# EAGLE design tvbnull-10mm (EAGLE 5.10)
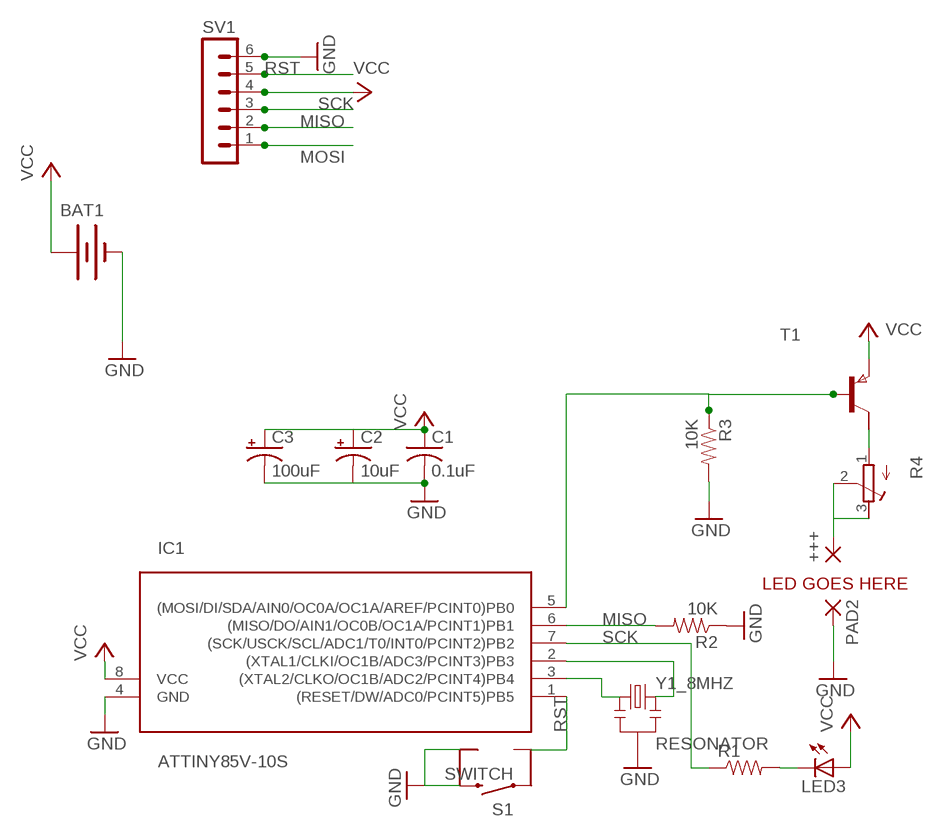
[diagram p0: schematic, sheet 1]

## Parts
+++  SMD5  [SMD2,54-5,08]
BAT1  BATTERYCR123A  [BATTERY_CR123A]
C1  0.1uF  C-USC0603K  [C0603K]
C2  10uF  CAP_POL1206  [EIA3216]
C3  100uF  CAP_POL7343  [EIA7343]
IC1  ATTINY85V-10S  [SOIC8]
LED3  LEDCHIPLED_1206  [CHIPLED_1206]
PAD2  SMD5  [SMD2,54-5,08]
R1  1.5K  RESISTOR1206  [1206]
R2  10K  RESISTOR  [0805]
R3  10K  RESISTOR  [0805]
R4  R-TRIMM3103  [RTRIM3103]
S1  SWITCH  SWITCH-MOMENTARY-2SMD  [TACTILE_SWITCH_SMD]
SV1  CON-LSTB_MA06-1  [CON-LSTB_MA06-1]
T1  PNPSOT89  [SOT89]
Y1_8MHZ  RESONATOR  RESONATORSMD  [RESONATOR-SMD]

## Nets
GND: BAT1.- C1.2 C2.C(-) C3.C(-) IC1.4(GND) PAD2.1(P) R2.1 R3.2 S1.3 S1.4 SV1.6 Y1_8MHZ.2
MISO: IC1.6((MISO/DO/AIN1/OC0B/OC1A/PCINT1)PB1) R2.2 SV1.2
MOSI: IC1.5((MOSI/DI/SDA/AIN0/OC0A/OC1A/AREF/PCINT0)PB0) R3.1 SV1.1 T1.1(B)
N$1: IC1.3((XTAL2/CLKO/OC1B/ADC2/PCINT4)PB4) Y1_8MHZ.1
N$2: IC1.2((XTAL1/CLKI/OC1B/ADC3/PCINT3)PB3) Y1_8MHZ.3
N$3: LED3.C R1.2
N$4: R4.1(E) T1.2@1(C1)
N$6: +++.1(P) R4.2(S) R4.3(A)
RST: IC1.1((RESET/DW/ADC0/PCINT5)PB5) S1.2 SV1.5
SCK: IC1.7((SCK/USCK/SCL/ADC1/T0/INT0/PCINT2)PB2) R1.1 SV1.3
VCC: BAT1.+ C1.1 C2.A(+) C3.A(+) IC1.8(VCC) LED3.A SV1.4 T1.3(E)
Unconnected: S1.1 T1.2(C)

## Notes on the sheet
- LED GOES HERE

## Library data of the parts
+++ PAD2 = wirepad:SMD5: SMD PAD
BAT1 = SparkFun:BATTERY: Battery Holders Various common sizes : AA, AAA, 20mm coin cell and 12mm coin cell.
C1 = rcl-ez:C-US: CAPACITOR, American symbol
C2 C3 = SparkFun:CAP_POL: Capacitor Polarized These are standard SMD and PTH capacitors. Normally 10uF, 47uF, and 100uF in electrolytic and tantalum varieties. Always verify the external diameter of the through hole cap, it varies with capacity, voltage, and manufacturer. The EIA devices should be standard.
IC1 = avr:ATTINY85: MICROCONTROLLER 8 Kbytes FLASH 512 bytes EEPROM 512 bytes RAM 4-channel 10 bit ADC USI
LED3 = minimidi:LED: LED OSRAM: - CHIPLED LG R971, LG N971, LY N971, LG Q971, LY Q971, LO R971, LY R971 LH N974, LH R974 LS Q976, LO Q976, LY Q976 LO Q996 - Hyper CHIPLED LW Q18S LB Q993, LB Q99A, LB R99A - SideLED LS A670, LO A670, LY A670, LG A670, LP A670 LB A673, LV A673, LT A673, LW A673 LH A674 LY A675 LS A676, LA A676, LO A676, LY A676, LW A676 LS A679, LY A679, LG A679 - Hyper Micro SIDELED® LS Y876, LA Y876, LO Y876, LY Y876 LT Y87S - SmartLED LW L88C, LW L88S LB L89C, LB L89S, LG L890 LS L89K, LO L89K, LY L89K LS L896, LA L896, LO L896, LY L896 - TOPLED LS T670, LO T670, LY T670, LG T670, LP T670 LSG T670, LSP T670, LSY T670, LOP T670, LYG T670 LG T671, LOG T671, LSG T671 LB T673, LV T673, LT T673, LW T673 LH T674 LS T676, LA T676, LO T676, LY T676, LB T676, LH T676, LSB T676, LW T676 LB T67C, LV T67C, LT T67C, LS T67K, LO T67K, LY T67K, LW E67C LS E67B, LA E67B, LO E67B, LY E67B, LB E67C, LV E67C, LT E67C LW T67C LS T679, LY T679, LG T679 LS T770, LO T770, LY T770, LG T770, LP T770 LB T773, LV T773, LT T773, LW T773 LH T774 LS E675, LA E675, LY E675, LS T675 LS T776, LA T776, LO T776, LY T776, LB T776 LHGB T686 LT T68C, LB T68C - Hyper Mini TOPLED® LB M676 - Mini TOPLED Santana® LG M470 LS M47K, LO M47K, LY M47K Source: http://www.osram.convergy.de/
R1-R3 = SparkFun:RESISTOR: Resistor Basic schematic elements and footprints for 0603, 1206, and PTH 1/10th watt (small) resistors.
R4 = resistor:R-TRIMM: Trimm resistor
S1 = SparkFun:SWITCH-MOMENTARY-2
SV1 = NSL:CON-LSTB_MA06-1: PIN HEADER
T1 = zetex:PNPSOT89: PNP TRANSISTOR
Y1_8MHZ = SparkFun:RESONATOR: Resonator Small SMD resonator. This is the itty bitty 10/20MHz resonators with built in caps. CSTCE10M0G55 and CSTCE20M0V53. Footprint has been reviewed closely but hasn't been tested yet.

## Board
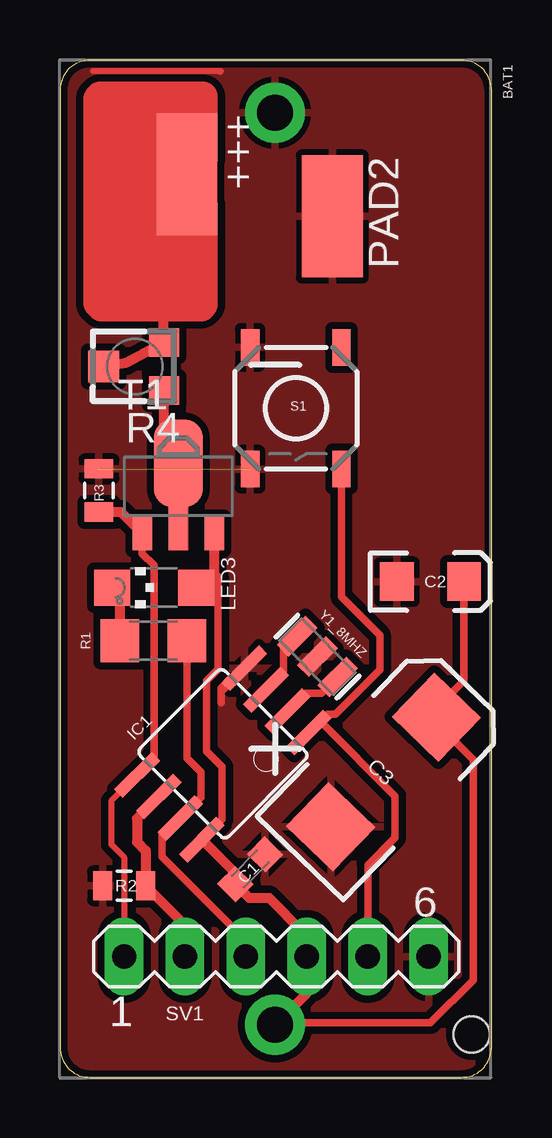
[diagram p1: board, top side]
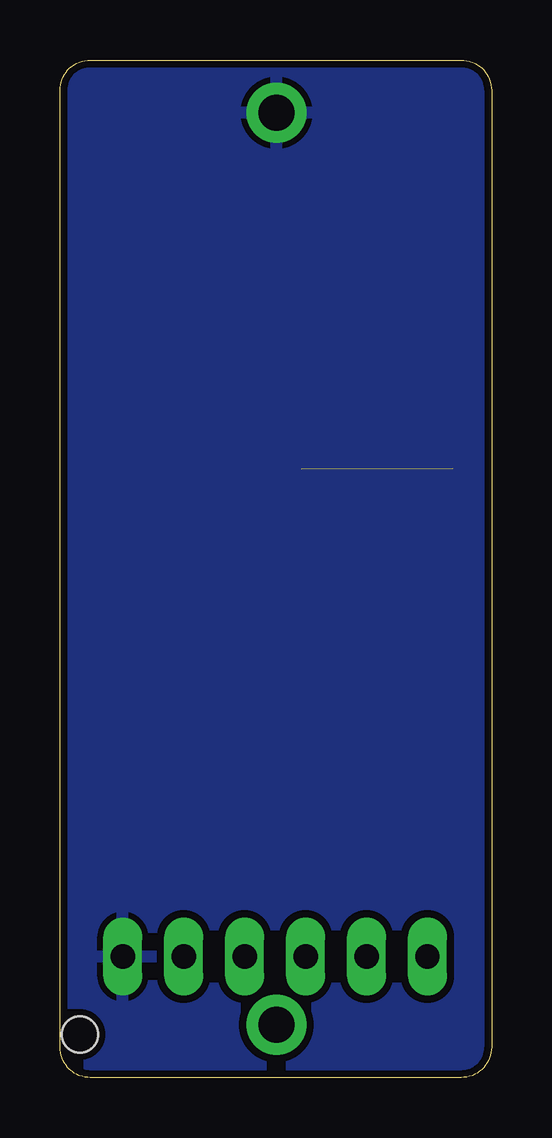
[diagram p2: board, bottom side, seen from below]

Size 18 x 42.4 mm. Coordinates in mm from the lower left corner, seen from the top.
Outline: 16.73,0 arc90 18,1.27 18,41.13 arc90 16.73,42.4 1.27,42.4 arc90 0,41.13 0,1.27 arc90 1.27,0 16.73,0
Copper layers (1*16): Top 0.0356mm / dielectric 1.5011mm / Bottom 0.0356mm
Design rules "SparkFun-mod": minimum track width 8mil, minimum drill 20mil, track to track 12mil, track to pad 12mil, pad to pad 8mil, via to via 8mil, smd to smd 8mil, copper to edge 12mil, drill to drill 8mil, minimum pad ring 12mil, minimum via ring 10mil, stop-mask expansion 4mil, vias tented up to drill 25mil, thermal gap 10mil

### Footprints (pad centres in the part's own frame; a part is rotated, then mirrored left to right if it is on the bottom)
SMD2,54-5,08 = smd 2.54 x 5.08: 1 0,0
BATTERY_CR123A = drill 1.5 pad 2.5 round: + 19,0; - -19,0 | hole 1.5: 19.4,8.2
C0603K = smd 1.05 x 1.08: 1 -0.875,0; 2 0.875,0
EIA3216 = smd 1.4 x 1.6: A 1.4,0; C -1.4,0
EIA7343 = smd 2.55 x 2.7: A 3.17,0; C -3.17,0
SOIC8 = smd 0.5 x 2.2: 1 -1.905,-3.154; 2 -0.645,-3.154; 3 0.625,-3.154; 4 1.895,-3.154; 5 1.905,3.154; 6 0.635,3.154; 7 -0.635,3.154; 8 -1.905,3.154
CHIPLED_1206 = smd 1.5 x 1.5: A 0,-1.75; C 0,1.75
1206 = smd 1.6 x 1.8: 1 -1.4,0; 2 1.4,0
0805 = smd 0.8 x 1.2: 1 -0.9,0; 2 0.9,0
RTRIM3103 = smd 1.2 x 1.25: 1 -1,-1.225; 3 1,-1.225 | smd 1.3 x 1.3: 2 0,1.3
TACTILE_SWITCH_SMD = smd 1.524 x 0.762: 1 -2.54,1.905; 2 2.54,1.905; 3 -2.54,-1.905; 4 2.54,-1.905
CON-LSTB_MA06-1 = drill 1.016 long: 1 -6.35,0; 2 -3.81,0; 3 -1.27,0; 4 1.27,0; 5 3.81,0; 6 6.35,0
SOT89 = smd 0.8 x 1.4: 1 -1.499,-1.981; 3 1.499,-1.981 | smd 0.8 x 1.9: 2 0,-1.727 | smd 2.032 x 3.65: 2@1 0,0.94
RESONATOR-SMD = smd 0.7 x 1.7: 1 -1.2,0; 2 0,0; 3 1.2,0

### Placement (x,y rotation side)
+++  5.29,37.63 180 top
BAT1  8.97,21.2 270 top
C1  7.93,8.68 45 top
C2  15.45,20.67 0 top
C3  13.5,12.74 46 top
IC1  6.8,13.49 135 top
LED3  3.92,20.41 90 top
PAD2  11.36,35.88 180 top
R1  3.89,18.2 180 top
R2  2.68,7.99 0 top
R3  1.62,24.46 90 top
R4  3.12,29.63 90 top
S1  9.84,27.89 270 top
SV1  9.03,5.05 0 top
T1  4.94,24.65 0 top
Y1_8MHZ  10.74,17.54 315 top

### Tracks (layer width: path | path; a pad name or v marks a point on that pad's centre or on a via)
GND  (1 unrouted)
  Top 0.254: 1.38,41.95 6.71,41.95 6.69,41.9
  Top 0.305: 6.71,16.07 7.6,16.96 | 6.71,16.07 6.71,15.61 | 6.71,16.07 6.71,16.22 7.15,16.65 7.35,16.65
  pour Top: -0.04,42.28 18.22,42.28 18.22,0.12 -0.04,-0.09
  pour Bottom: -0.73,43.12 19.08,43.12 18.98,-0.44 -0.4,-0.77
MISO
  Top 0.406: SV1.2 5.22,6.35 R2.2 3.58,9.45 3.21,9.82 3.21,10.8 IC1.6
MOSI
  Top 0.254: SV1.1 2.68,9.19 2.14,9.72 2.14,11.53 IC1.5
  Top 0.305: T1.1 3.44,21.84 3.92,21.35 3.92,13.31 IC1.5
  Top 0.406: T1.1 2.55,23.56 R3.1
N$1
  Top 0.305: IC1.3 8.59,16.22 9.33,16.96 9.33,17.83 Y1_8MHZ.1
N$2
  Top 0.305: IC1.2 10.24,16.02 10.91,16.02 Y1_8MHZ.3
N$3
  Top 0.406: R1.2 2.49,20.09 LED3.C
N$4
  Top 0.406: T1.2@1 4.34,26.19 R4.1
N$6
  Top 0.406: R4.2 2.77,29.8 R4.3 4.29,32.55 4.33,32.58
  Top 1.27: +++.1 5.95,38.29 5.95,40.86 1.68,40.86 1.61,40.78 1.61,32.27 1.74,32.15 5.88,32.15 5.95,32.22 5.95,36.34 5.01,37.28 5.01,40.3 4.89,40.17 2.37,40.17 2.37,32.71 2.62,32.96 5.06,32.96 5.14,33.04 5.14,35.53 4.15,34.53 4.15,33.92 3.89,33.67 3.23,33.67 3.51,33.95 3.51,39.95 4.33,39.13 4.33,32.58
RST
  Top 0.305: SV1.5 12.84,8.86 13.98,10 13.98,11.73 10.88,14.82 | 10.88,14.82 10.83,14.82 IC1.1 | 10.88,14.82 10.88,14.85 11.16,15.13 11.49,15.13 13.34,16.98 13.34,18.43 12.33,19.45 11.74,20.03 S1.2
SCK
  Top 0.305: SV1.3 7.76,5.71 4.25,9.21 4.25,10.13 4.94,10.81 | 4.94,10.81 IC1.7 | 4.94,10.81 5.6,11.47 5.67,11.47 5.67,11.5 5.7,11.5 5.88,11.67 5.88,12.72 5.29,13.3 R1.1
VCC
  Top 0.305: IC1.8 6.61,10.61 6.76,10.76 6.76,12.94 6.1,13.61 6.1,16.53 6.59,17.01 6.59,20.87 6.46,21 | 5.67,20.09 LED3.A 5.8,20.41 6.41,19.8 6.41,20.64 6.05,21 6.46,21 | BAT1.+ 9.05,2.28 15.45,2.28 17.23,4.05 17.23,13.25 15.7,14.78 C3.A 15.7,15.38 16.85,16.53 C2.A | 6.46,21 6.46,20.49 6.38,20.41
  Top 0.406: BAT1.+ 10.3,3.52 SV1.4 | 10.27,4.94 10.27,6.06 10.14,6.06 8.72,7.48 7.89,7.48 C1.1 7.31,8.52 IC1.8 | 6.46,20.49 6.43,20.51 T1.3
  Top 0.61: 10.27,4.94 SV1.4

### Text on the board
_tsilk: [ | NSL | ]